# Altium schematic sheet top.SchDoc: Triumvi - Top
size Letter; Author: Ye-Sheng Kuo; Revision: 12; SheetNumber: 1; SheetTotal: 9
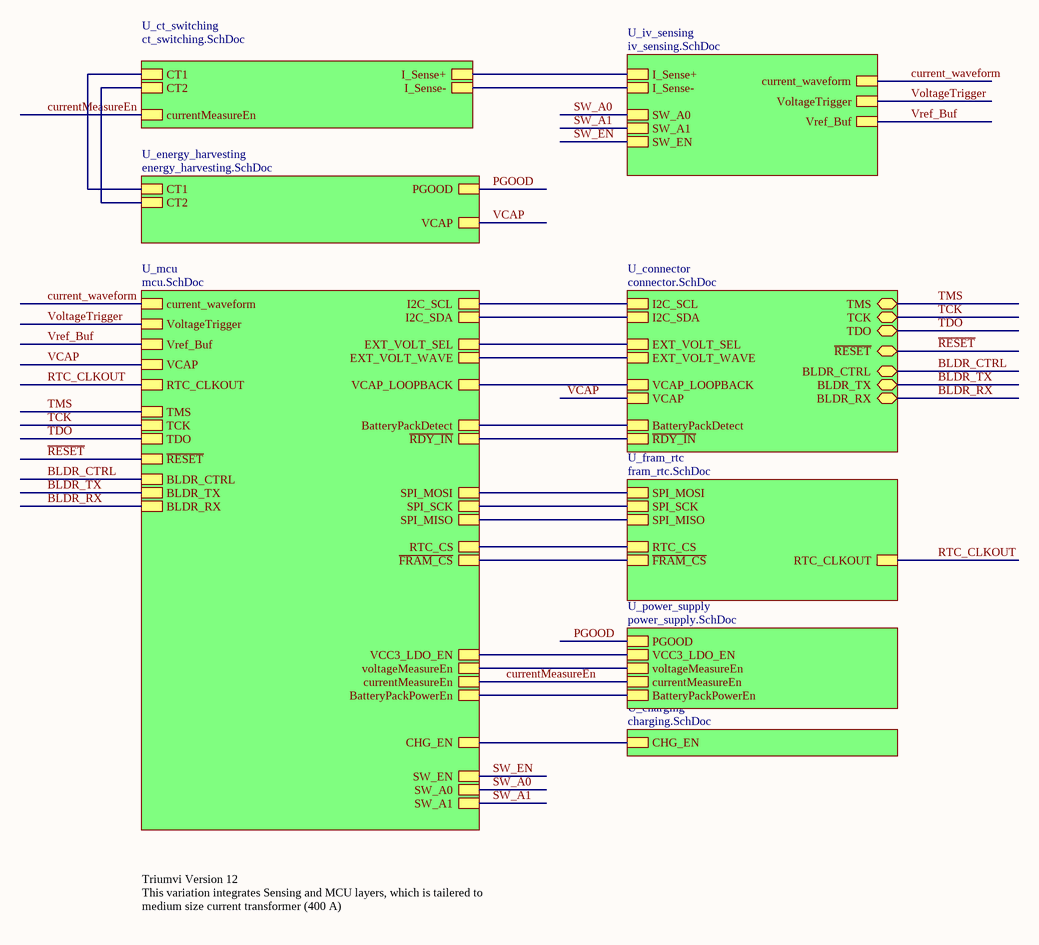
[diagram p0: top.SchDoc]

## Sub-sheets
U_charging = charging.SchDoc: CHG_EN
U_connector = connector.SchDoc: I2C_SCL, I2C_SDA, EXT_VOLT_SEL, EXT_VOLT_WAVE, BatteryPackDetect, VCAP_LOOPBACK, VCAP, ~{RDY_IN}, TMS, TCK, TDO, BLDR_CTRL, BLDR_TX, BLDR_RX, ~{RESET}
U_ct_switching = ct_switching.SchDoc: CT1, CT2, currentMeasureEn, I_Sense+, I_Sense-
U_energy_harvesting = energy_harvesting.SchDoc: CT1, CT2, PGOOD, VCAP
U_fram_rtc = fram_rtc.SchDoc: SPI_MOSI, SPI_SCK, SPI_MISO, RTC_CS, ~{FRAM_CS}, RTC_CLKOUT
U_iv_sensing = iv_sensing.SchDoc: current_waveform, Vref_Buf, VoltageTrigger, I_Sense+, I_Sense-, SW_A0, SW_A1, SW_EN
U_mcu = mcu.SchDoc: current_waveform, Vref_Buf, voltageMeasureEn, currentMeasureEn, VoltageTrigger, ~{FRAM_CS}, SPI_SCK, SPI_MOSI, SPI_MISO, RTC_CS, I2C_SCL, I2C_SDA, EXT_VOLT_SEL, EXT_VOLT_WAVE, TDO, BLDR_CTRL, BLDR_TX, BLDR_RX, ~{RESET}, TMS, TCK, VCC3_LDO_EN, BatteryPackDetect, VCAP_LOOPBACK, VCAP, ~{RDY_IN}, SW_EN, RTC_CLKOUT, SW_A0, SW_A1, CHG_EN, BatteryPackPowerEn
U_power_supply = power_supply.SchDoc: PGOOD, VCC3_LDO_EN, voltageMeasureEn, currentMeasureEn, BatteryPackPowerEn

## Nets
BLDR_CTRL: sheet U_connector/BLDR_CTRL, sheet U_mcu/BLDR_CTRL
BLDR_RX: sheet U_connector/BLDR_RX, sheet U_mcu/BLDR_RX
BLDR_TX: sheet U_connector/BLDR_TX, sheet U_mcu/BLDR_TX
current_waveform: sheet U_iv_sensing/current_waveform, sheet U_mcu/current_waveform
currentMeasureEn: sheet U_ct_switching/currentMeasureEn, sheet U_mcu/currentMeasureEn, sheet U_power_supply/currentMeasureEn
PGOOD: sheet U_energy_harvesting/PGOOD, sheet U_power_supply/PGOOD
~{RESET}: sheet U_connector/~{RESET}, sheet U_mcu/~{RESET}
RTC_CLKOUT: sheet U_fram_rtc/RTC_CLKOUT, sheet U_mcu/RTC_CLKOUT
SW_A0: sheet U_iv_sensing/SW_A0, sheet U_mcu/SW_A0
SW_A1: sheet U_iv_sensing/SW_A1, sheet U_mcu/SW_A1
SW_EN: sheet U_iv_sensing/SW_EN, sheet U_mcu/SW_EN
TCK: sheet U_connector/TCK, sheet U_mcu/TCK
TDO: sheet U_connector/TDO, sheet U_mcu/TDO
TMS: sheet U_connector/TMS, sheet U_mcu/TMS
VCAP: sheet U_connector/VCAP, sheet U_energy_harvesting/VCAP, sheet U_mcu/VCAP
VoltageTrigger: sheet U_iv_sensing/VoltageTrigger, sheet U_mcu/VoltageTrigger
Vref_Buf: sheet U_iv_sensing/Vref_Buf, sheet U_mcu/Vref_Buf
(unnamed): sheet U_charging/CHG_EN, sheet U_mcu/CHG_EN
(unnamed): sheet U_connector/I2C_SCL, sheet U_mcu/I2C_SCL
(unnamed): sheet U_connector/I2C_SDA, sheet U_mcu/I2C_SDA
(unnamed): sheet U_connector/EXT_VOLT_SEL, sheet U_mcu/EXT_VOLT_SEL
(unnamed): sheet U_connector/EXT_VOLT_WAVE, sheet U_mcu/EXT_VOLT_WAVE
(unnamed): sheet U_connector/BatteryPackDetect, sheet U_mcu/BatteryPackDetect
(unnamed): sheet U_connector/VCAP_LOOPBACK, sheet U_mcu/VCAP_LOOPBACK
(unnamed): sheet U_connector/~{RDY_IN}, sheet U_mcu/~{RDY_IN}
(unnamed): sheet U_ct_switching/CT1, sheet U_energy_harvesting/CT1
(unnamed): sheet U_ct_switching/CT2, sheet U_energy_harvesting/CT2
(unnamed): sheet U_ct_switching/I_Sense+, sheet U_iv_sensing/I_Sense+
(unnamed): sheet U_ct_switching/I_Sense-, sheet U_iv_sensing/I_Sense-
(unnamed): sheet U_fram_rtc/SPI_MOSI, sheet U_mcu/SPI_MOSI
(unnamed): sheet U_fram_rtc/SPI_SCK, sheet U_mcu/SPI_SCK
(unnamed): sheet U_fram_rtc/SPI_MISO, sheet U_mcu/SPI_MISO
(unnamed): sheet U_fram_rtc/RTC_CS, sheet U_mcu/RTC_CS
(unnamed): sheet U_fram_rtc/~{FRAM_CS}, sheet U_mcu/~{FRAM_CS}
(unnamed): sheet U_mcu/voltageMeasureEn, sheet U_power_supply/voltageMeasureEn
(unnamed): sheet U_mcu/VCC3_LDO_EN, sheet U_power_supply/VCC3_LDO_EN
(unnamed): sheet U_mcu/BatteryPackPowerEn, sheet U_power_supply/BatteryPackPowerEn

## Notes on the sheet
- Triumvi Version 12
  This variation integrates Sensing and MCU layers, which is tailered to medium size current transformer (400 A)
- Title
- Date:
- Author:
- Revision:
- Sheet
- of
- University of Michigan
- File: